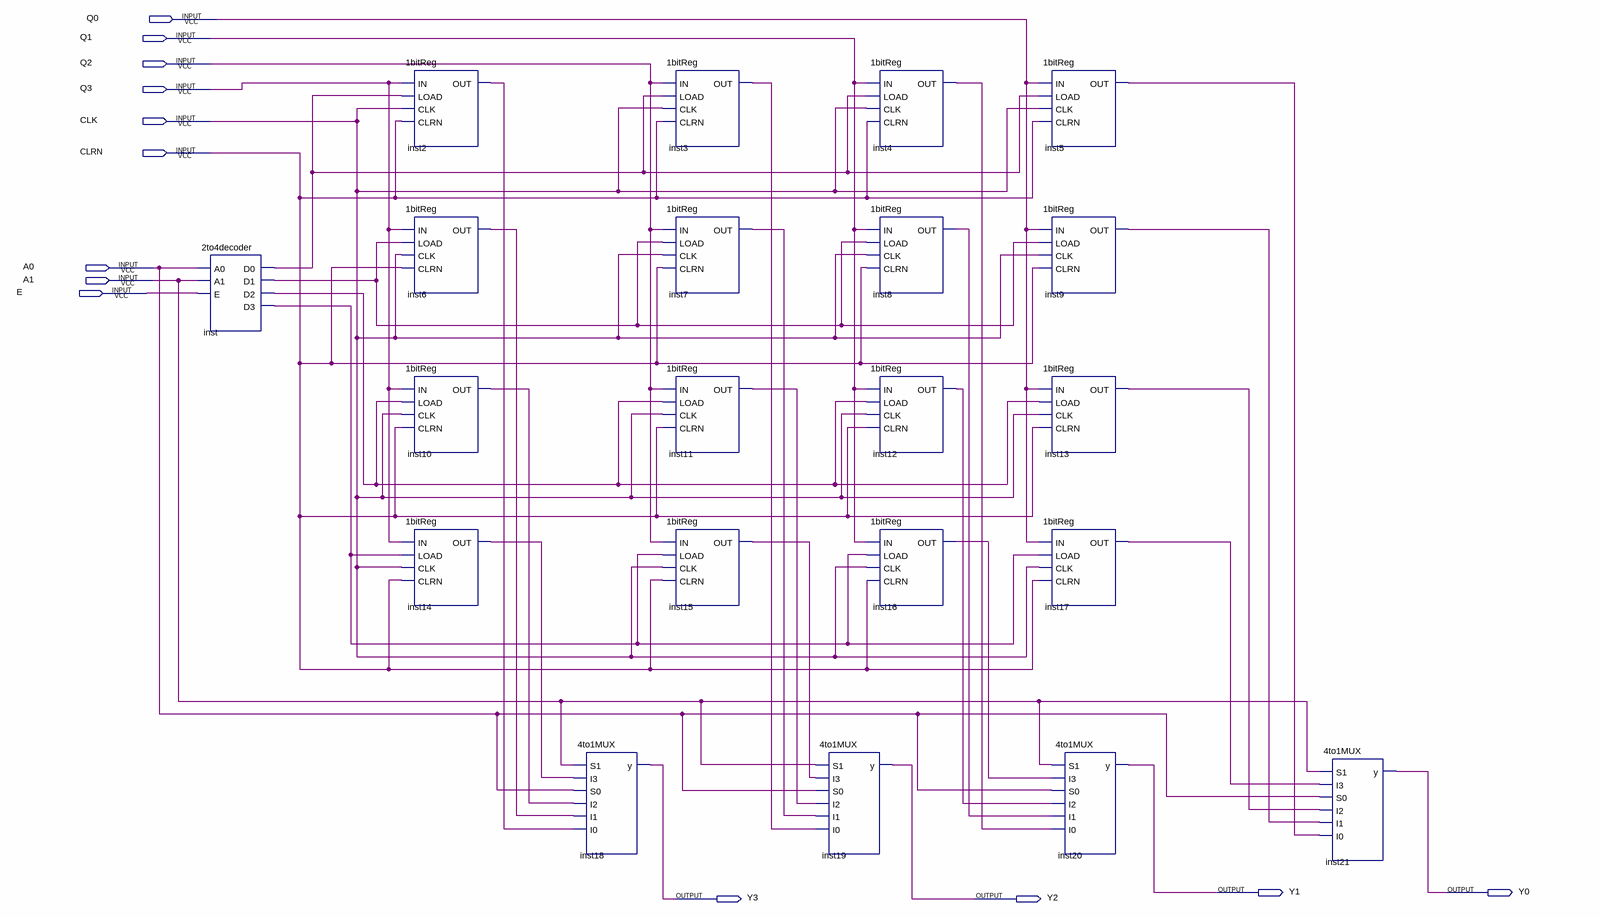
[diagram p0: schematic sheet]
// Quartus schematic register.bdf as structural Verilog: 21 symbols, 13 pins
module register (
  input  Q0,
  input  Q1,
  input  Q2,
  input  Q3,
  input  CLK,
  input  CLRN,
  input  A0,
  input  A1,
  input  E,
  output Y1,
  output Y0,
  output Y3,
  output Y2
);

  wire inst2_out, inst3_out, inst4_out, inst5_out, inst6_out, inst7_out, inst8_out, inst9_out, inst10_out,
       inst11_out, inst12_out, inst13_out, inst14_out, inst15_out, inst16_out, inst17_out, inst_d0, inst_d1,
       inst_d2, inst_d3;

  \2to4decoder  inst (.A0(A0), .A1(A1), .E(E), .D0(inst_d0), .D1(inst_d1), .D2(inst_d2), .D3(inst_d3));
  \1bitReg  inst2 (.IN(Q3), .LOAD(inst_d0), .CLK(CLK), .CLRN(CLRN), .OUT(inst2_out));
  \1bitReg  inst6 (.IN(Q3), .LOAD(inst_d1), .CLK(CLK), .CLRN(CLRN), .OUT(inst6_out));
  \1bitReg  inst10 (.IN(Q3), .LOAD(inst_d2), .CLK(CLK), .CLRN(CLRN), .OUT(inst10_out));
  \1bitReg  inst14 (.IN(Q3), .LOAD(inst_d3), .CLK(CLK), .CLRN(CLRN), .OUT(inst14_out));
  \4to1MUX  inst18 (.S1(A1), .I3(inst14_out), .S0(A0), .I2(inst10_out), .I1(inst6_out), .I0(inst2_out), .y(Y3));
  \1bitReg  inst3 (.IN(Q2), .LOAD(inst_d0), .CLK(CLK), .CLRN(CLRN), .OUT(inst3_out));
  \1bitReg  inst7 (.IN(Q2), .LOAD(inst_d1), .CLK(CLK), .CLRN(CLRN), .OUT(inst7_out));
  \1bitReg  inst11 (.IN(Q2), .LOAD(inst_d2), .CLK(CLK), .CLRN(CLRN), .OUT(inst11_out));
  \1bitReg  inst15 (.IN(Q2), .LOAD(inst_d3), .CLK(CLK), .CLRN(CLRN), .OUT(inst15_out));
  \4to1MUX  inst19 (.S1(A1), .I3(inst15_out), .S0(A0), .I2(inst11_out), .I1(inst7_out), .I0(inst3_out), .y(Y2));
  \1bitReg  inst4 (.IN(Q1), .LOAD(inst_d0), .CLK(CLK), .CLRN(CLRN), .OUT(inst4_out));
  \1bitReg  inst8 (.IN(Q1), .LOAD(inst_d1), .CLK(CLK), .CLRN(CLRN), .OUT(inst8_out));
  \1bitReg  inst12 (.IN(Q1), .LOAD(inst_d2), .CLK(CLK), .CLRN(CLRN), .OUT(inst12_out));
  \1bitReg  inst16 (.IN(Q1), .LOAD(inst_d3), .CLK(CLK), .CLRN(CLRN), .OUT(inst16_out));
  \1bitReg  inst5 (.IN(Q0), .LOAD(inst_d0), .CLK(CLK), .CLRN(CLRN), .OUT(inst5_out));
  \1bitReg  inst9 (.IN(Q0), .LOAD(inst_d1), .CLK(CLK), .CLRN(CLRN), .OUT(inst9_out));
  \1bitReg  inst13 (.IN(Q0), .LOAD(inst_d2), .CLK(CLK), .CLRN(CLRN), .OUT(inst13_out));
  \1bitReg  inst17 (.IN(Q0), .LOAD(inst_d3), .CLK(CLK), .CLRN(CLRN), .OUT(inst17_out));
  \4to1MUX  inst20 (.S1(A1), .I3(inst16_out), .S0(A0), .I2(inst12_out), .I1(inst8_out), .I0(inst4_out), .y(Y1));
  \4to1MUX  inst21 (.S1(A1), .I3(inst17_out), .S0(A0), .I2(inst13_out), .I1(inst9_out), .I0(inst5_out), .y(Y0));
endmodule
